# EAGLE design example2_PassBand (EAGLE 9.4.2)
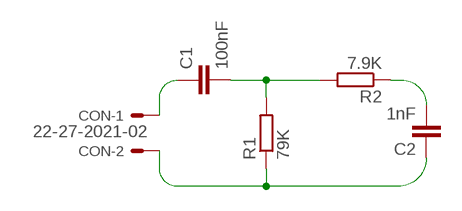
[diagram p0: schematic, sheet 1]

## Parts
C1  100nF  C5/2.5  [C5B2.5]
C2  1nF  C5/2.5  [C5B2.5]
CON  22-27-2021-02  [6410-02]
R1  79K  R-EU_0204/7  [0204/7]
R2  7.9K  R-EU_0204/7  [0204/7]

## Nets
N$1: C1.1 CON.1
N$2: C1.2 R1.2 R2.2
N$3: C2.2 R2.1
N$4: C2.1 CON.2 R1.1

## Library data of the parts
C1 C2 = capacitor-wima:C: CAPACITOR naming: grid - package width
CON = con-molex:22-?-02: CONNECTOR wire to board 2.54 mm (.1 inch) pitch header; MF: MOLEX; OC_FARNELL: unknown; OC_NEWARK: unknown
R1 R2 = rcl:R-EU_: RESISTOR, European symbol; SPICEPREFIX: R

## Board
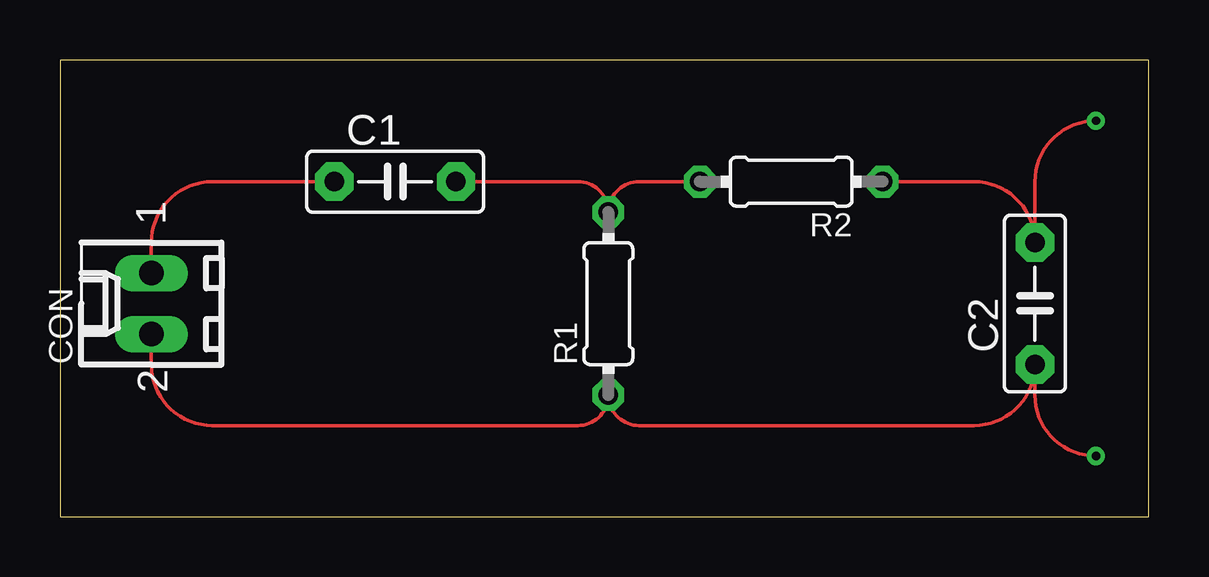
[diagram p1: board, top side]

Size 45.39 x 19.04 mm. Coordinates in mm from the lower left corner, seen from the top.
Outline: 0,0 45.39,0 45.39,19.04 0,19.04 0,0
Copper layers (1*16): Top 0.035mm / dielectric 1.5mm / Bottom 0.035mm
Design rules "default": minimum track width 6mil, minimum drill 0.35mm, track to track 6mil, track to pad 6mil, pad to pad 6mil, via to via 6mil, smd to smd 6mil, copper to edge 40mil, drill to drill 6mil, minimum pad ring 10mil, minimum via ring 8mil, stop-mask expansion 4mil, vias tented up to drill 0mil, thermal gap 10mil

### Footprints (pad centres in the part's own frame; a part is rotated, then mirrored left to right if it is on the bottom)
C5B2.5 = drill 0.813 pad 1.6 octagon: 1 -2.54,0; 2 2.54,0
6410-02 = drill 1.016 long: 1 1.27,0; 2 -1.27,0
0204/7 = drill 0.813 octagon: 1 -3.81,0; 2 3.81,0

### Placement (x,y rotation side)
C1  13.97,13.97 0 top
C2  40.64,8.89 90 top
CON  3.81,8.89 90 top
R1  22.86,8.89 90 top
R2  30.48,13.97 180 top

### Tracks (layer width: path | path; a pad name or v marks a point on that pad's centre or on a via)
N$1
  Top 0.152: CON.1 3.81,11.43 arc-90 6.35,13.97 C1.1
N$2
  Top 0.152: C1.2 21.59,13.97 arc-90 R1.2 arc-90 24.13,13.97 R2.2
N$3
  Top 0.152: R2.1 38.1,13.97 arc-90 C2.2 40.64,13.97 arc-90 43.18,16.51
N$4
  Top 0.152: CON.2 3.81,6.35 arc90 6.35,3.81 21.59,3.81 arc90 R1.1 arc90 24.13,3.81 38.1,3.81 arc90 C2.1 40.64,5.08 arc90 43.18,2.54
N$5  (via drill 0.35)
  other vias: 43.18,16.51
N$6  (via drill 0.35)
  other vias: 43.18,2.54